# Altium schematic sheet [15] - BOOT OPTIONS.SchDoc: BOOT OPTIONS
size B; Organization: Altium Limited; Address1: L3, 12a Rodborough Rd; Address2: Frenchs Forest; Address3: NSW; Address4: Australia 2086; DocumentNumber: 15; Revision: V1I1; SheetNumber: 15; SheetTotal: 16
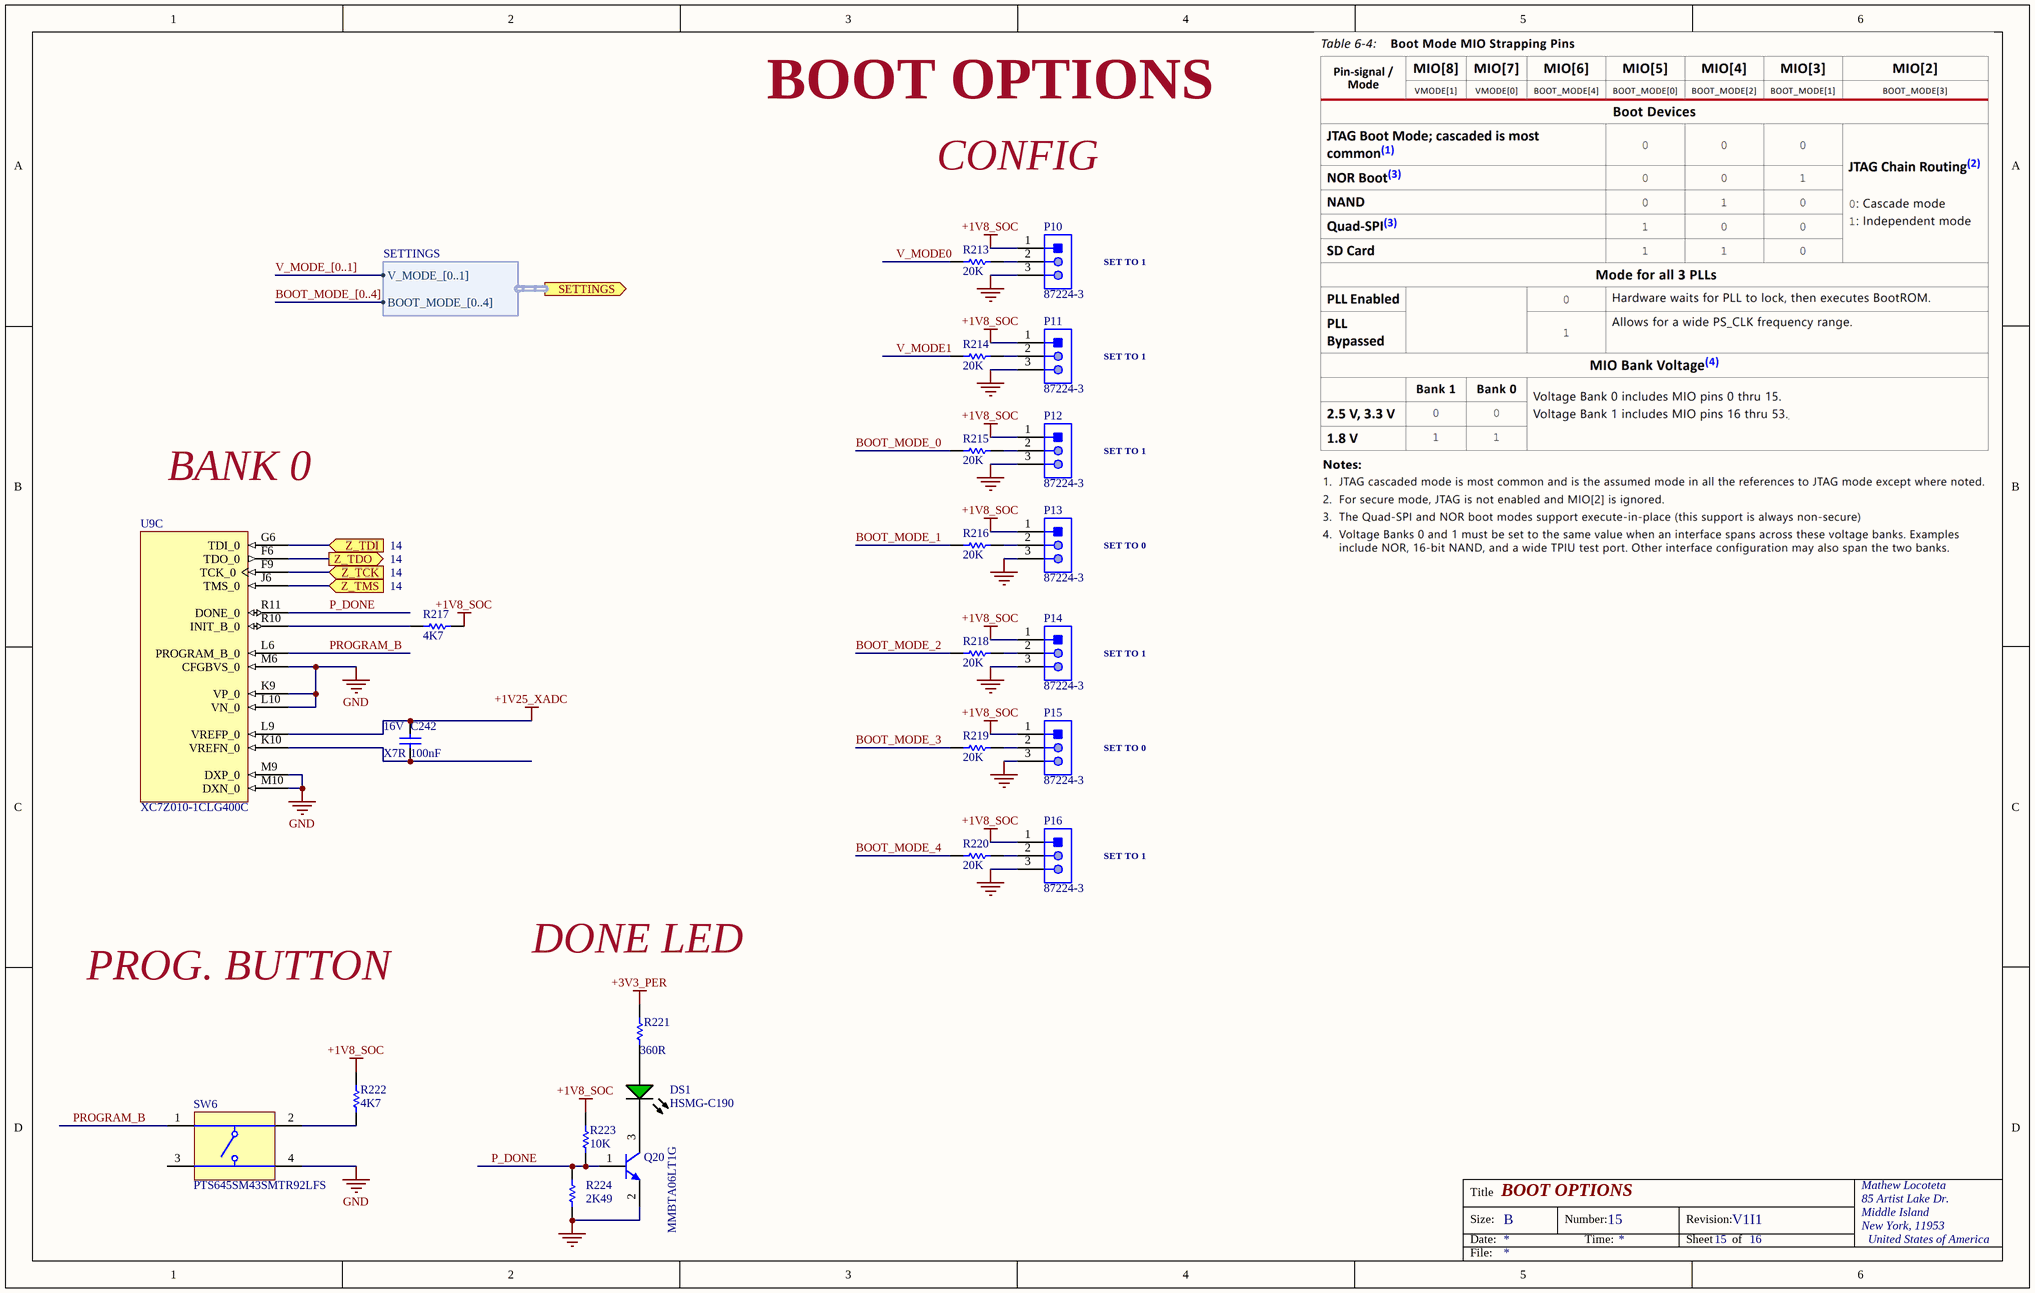
[diagram p0: [15] - BOOT OPTIONS.SchDoc]

## Parts
C242  Dielectric: X7R  Voltage Rating: 16V  Capacitance: 100nF  (hidden comment: 100nF 0402 16V)
DS1  HSMG-C190  [AVAG-HSMX-C190_V]
P10  87224-3  [TECO-87224-3_V]
P11  87224-3  [TECO-87224-3_V]
P12  87224-3  [TECO-87224-3_V]
P13  87224-3  [TECO-87224-3_V]
P14  87224-3  [TECO-87224-3_V]
P15  87224-3  [TECO-87224-3_V]
P16  87224-3  [TECO-87224-3_V]
Q20  MMBTA06LT1G  [ONSC-SOT-23-3-318-08_V]
R213  Resistance: 20K  (hidden comment: 20K 1/8W 1% 0402)
R214  Resistance: 20K  (hidden comment: 20K 1/8W 1% 0402)
R215  Resistance: 20K  (hidden comment: 20K 1/8W 1% 0402)
R216  Resistance: 20K  (hidden comment: 20K 1/8W 1% 0402)
R217  Resistance: 4K7  (hidden comment: 4K7 0402 1%)
R218  Resistance: 20K  (hidden comment: 20K 1/8W 1% 0402)
R219  Resistance: 20K  (hidden comment: 20K 1/8W 1% 0402)
R220  Resistance: 20K  (hidden comment: 20K 1/8W 1% 0402)
R221  value 360R  [RESC1005X40X25NL05T05]  (hidden comment: CRCW0402360RFKED)
R222  Resistance: 4K7  (hidden comment: 4K7 0402 1%)
R223  value 10K  [RESC1005X40X25ML05T10]  (hidden comment: CRCW040210K0FKEDHP)
R224  value 2K49  [RESC1005X40X25ML05T05]  (hidden comment: CRCW04022K49FKTD)
SW6  PTS645SM43SMTR92LFS  [ITT-PTS645S-4_V]
U9  XC7Z010-1CLG400C  [CLG400]  (part C of 9)

## Ports
SETTINGS (out, harness SETTINGS), Z_TCK (in), Z_TDI (in), Z_TDO (out), Z_TMS (in)

## Harnesses
SETTINGS: BOOT_MODE_[0..4], V_MODE_[0..1]

## Nets
+1V8_SOC: P10.1 P11.1 P12.1 P13.1 P14.1 P15.1 P16.1 R217.2 R222.1 R223.2
+1V25_XADC: C242.2 U9.L9(VREFP_0)
+3V3_PER: R221.2
GND: P10.3 P11.3 P12.3 P13.3 P14.3 P15.3 P16.3 Q20.2(E) R224.1 SW6.4 U9.K9(VP_0) U9.L10(VN_0) U9.M6(CFGBVS_0) U9.M9(DXP_0) U9.M10(DXN_0)
BOOT_MODE_0: R215.1
BOOT_MODE_1: R216.1
BOOT_MODE_2: R218.1
BOOT_MODE_3: R219.1
BOOT_MODE_4: R220.1
P_DONE: Q20.1(B) R223.1 R224.2 U9.R11(DONE_0)
PROGRAM_B: SW6.1 U9.L6(PROGRAM_B_0)
V_MODE0: R213.1
V_MODE1: R214.1
Z_TCK: U9.F9(TCK_0) ; port Z_TCK
Z_TDI: U9.G6(TDI_0) ; port Z_TDI
Z_TDO: U9.F6(TDO_0) ; port Z_TDO
Z_TMS: U9.J6(TMS_0) ; port Z_TMS
NetC242_1: C242.1 U9.K10(VREFN_0)
NetDS1_1: DS1.1(A) R221.1
NetDS1_2: DS1.2(K) Q20.3(C)
NetP10_2: P10.2 R213.2
NetP11_2: P11.2 R214.2
NetP12_2: P12.2 R215.2
NetP13_2: P13.2 R216.2
NetP14_2: P14.2 R218.2
NetP15_2: P15.2 R219.2
NetP16_2: P16.2 R220.2
NetR217_1: R217.1 U9.R10(INIT_B_0)
NetR222_2: R222.2 SW6.2

Not connected (* = marked no-connect by the designer): SW6 3

## Buses and harness runs
bus BOOT_MODE_[0..4]
bus V_MODE_[0..1]

## Notes on the sheet
- BOOT OPTIONS
- CONFIG
- SET TO 1
- BANK 0
- 14
- (near R217) 14
- SET TO 0
- DONE LED
- PROG. BUTTON
- Title
- Size:
- Date:
- B
- Number:
- Time:
- Revision:
- Sheet
- of
- Mathew Locoteta
- 85 Artist Lake Dr.
- Middle Island
- New York, 11953
- United States of America
- File:

## Library data of the parts
C242 = C0402C104J4RACTU: KEMET - C0402C104J4RACTU - SMD Multilayer Ceramic Capacitor, 0.1 µF, 16 V, 0402 [1005 Metric], ± 5%, X7R, C Series KEMET; Dissipation Factor: 3.5%; Supplier 1: Digi-Key; Manufacturer: KEMET; Manufacturer Part Number: C0402C104J4RACTU; RoHS: Yes; Category: Ceramic Capacitors; Stock 1: 106350; Pricing 1: 1=0.48000, 10=0.33900, 50=0.25620, 100=0.22310, 500=0.16528, 1000=0.14049, 2500=0.13223, 5000=0.12396 (USD); Mount: Surface Mount,PCB; Case/Package: 0402; Case Code (Metric): 1005; Case Code (Imperial): 0402; Dielectric Material: Ceramic; Contact Plating: Tin,Matte; Min Operating Temperature: -55°C; Max Operating Temperature: 125°C; Tolerance: 5%; Packaging: Tape and Reel; Package Quantity: 1; Termination: SMD/SMT; Voltage: 16V; Length: 1mm; Height: 0.5mm; Width: 0.02inch; Thickness: 0.022inch; Depth: 0.5mm; Radiation Hardening: No; REACH SVHC: No SVHC; ComponentLink1URL: https://datasheet.ciiva.com/5415/kem-c1002-x7r-smd-5415819.pdf?src-supplier=Mouser; ComponentLink1Description: https://datasheet.ciiva.com/5415/kem-c1002-x7r-smd-5415819.pdf?src-supplier=Mouser; ComponentLink2URL: https://datasheet.ciiva.com/46424/1851736-46424159.pdf?src-supplier=Element14; ComponentLink2Description: https://datasheet.ciiva.com/46424/1851736-46424159.pdf?src-supplier=Element14; Supplier Part Number 1: 399-7761-1-ND; Voltage Rating (DC): 16V
DS1 = CMP-1744-00002-1: Chip LED, Green, 2.2 V, -40 to 85 degC, 2-Pin SMD, RoHS, Tape and Reel; Frequency: 400 KHz; Max Supply Voltage: 5.5 V; Access Time: 3500 ns; Clock Frequency: 100 KHz; Case\Package: SOIC; Density: 32 kb; Nominal Supply Current: 2 mA; Interface: Serial; Min Supply Voltage: 1.7 V; Packaging: Tape and Reel; PackageReference: HSMX-C190; ComponentLink2URL: http://docs.avagotech.com/docs/AV02-0551EN; RoHSCompliant: true; Pins: 8; REACH SVHC: No SVHC; Max Operating Temperature: 85 degC; Width: 4 mm; Radiation Hardening: No; Package Quantity: 3000; ComponentLink3Description: Package Specification; ComponentLink1Description: Manufacturer URL; Min Operating Temperature: -40 degC; PackageDescription: 2-Pin Surface Mount Device, Body 1.6 x 0.8 mm, Height 0.9 mm; Max Clock Frequency: 100 KHz; Height: 1.5 mm; ComponentLink1URL: http://www.avagotech.com/; DatasheetVersion: Mar-12; ComponentLink2Description: Datasheet; Mount: Surface Mount; Length: 5 mm; ComponentLink3URL: http://www.fairchildsemi.com/dwg/MA/MA03D.pdf
P10-P16 = CMP-2000-05697-1: Male Header, Pitch 2.54 mm, 1 x 3 Position, Height 10.744 mm, Tail Length 3.175 mm, -65 to 105 degC, RoHS, Bulk; Manufacturer: TE Connectivity; Catalog Drawings: SingleSquareStraightPost / SingleSquareStraightPostSide; Connector Type: Header,Unshrouded; Pitch: 0.100"(2.54mm); Mating Products: 147738-2-ND / -CONNRCPT3POSVERTSMDGOLD / 147723-2-ND / -CONNRCPT3POSVERT.100GOLD / 146763-5-ND / -CONNRCPT3POSSGLVERT.100T/H / A32904-ND / -CONNRECEPT3POS.100VERTGOLD / A26922-ND / -CONNHOUSING3POS.100LOCKING / A26415-ND / -CONNRECEPT3POS.100VERTAU / A26964-ND / -CONNHOUSING3POS.100SINGLE / A3012-ND / -CONNHOUSING3POS.100SINGLE; Number of Positions Loaded: All; Featured Product: AMPMODUConnectors; Dynamic Catalog: AMPMODUModIISeries; 3D Model: 87224-3.pdf; Other Names: 87224-3-ND / A26545; Number of Positions: 3; RoHS Information: 87224-3StatementofCompliance; Termination: Solder; Datasheet URL: http://www.te.com/commerce/DocumentDelivery/DDEController?Action=showdoc&DocId=Customer+Drawing%7F87224%7FL3%7Fpdf%7FEnglish%7FENG_CD_87224_L3.pdf%7F87224-3; Category: Connectors,Interconnects; Contact Mating Length: 0.318"(8.08mm); Standard Package: 520; Mounting Type: ThroughHole; Family: RectangularConnectors-Headers,MalePins; Number of Rows: 1; Series: AMPMODUModII; Contact Finish Thickness: 15µin(0.38µm); Datasheet Version: Rev. L3, 08/2015; Package Reference: 87224-3; Mounting Technology: ThroughHole; Manufacturer URL: http://www.te.com/; Contact Type: MalePin; Packaging: Bulk; Color: Black; Package Description: Male Header, Pitch 2.54 mm, 1 x 3 Position, Height 10.744 mm, Tail Length 3.175 mm; Contact Finish: Gold
Q20 = CMP-1048-00619-1: Driver Transistor, NPN Silicon, 3-Pin SOT-23, Pb-Free, Tape and Reel; Manufacturer: On Semiconductor; IC Continuous (A): 0.5; fT Min (MHz): 100; ComponentLink1URL: http://www.onsemi.com/; ComponentLink1Description: Manufacturer URL; ComponentLink2Description: Datasheet; ComponentLink3URL: http://www.onsemi.cn/pub_link/Collateral/318-08.PDF; Packing: Tape and Reel; PackageVersion: Rev. AP, 11/2009; PackageDescription: 3-Pin Small Outline Transistor, Body 2.92 x 1.3 mm, Pitch 0.95 mm; RoHS: TRUE; PartNumber: MMBTA06LT1G; ComponentLink2URL: http://www.onsemi.cn/pub_link/Collateral/MMBTA05LT1-D.PDF; DatasheetVersion: Rev. 8; PackageReference: SOT-23-3-318-08; Polarity: NPN; ComponentLink3Description: Package Specification; Mounting Technology: Surface Mount
R213-R216 R218-R220 = CRCW040220K0FKEDHP: Res Thick Film 0402 20K Ohm 1% 1/8W 100ppm/C Molded SMD SMD Paper T/R; Manufacturer: Vishay Dale; Temperature Coefficient: 100ppm/°C; Voltage Rating: 50V; Max Power Dissipation: 125mW; Supplier 1: Digi-Key; Manufacturer Part Number: CRCW040220K0FKEDHP; RoHS: Yes; Category: Chip SMD Resistors; Stock 1: 24303; Pricing 1: 1=0.14000, 10=0.12100, 100=0.04670, 1000=0.02053, 2500=0.01773, 5000=0.01586 (USD); Mount: Surface Mount; Case/Package: 0402; Weight: 2.3E-05oz; Contact Plating: Tin; Case Code (Metric): 1005; Case Code (Imperial): 0402; Min Operating Temperature: -55°C; Max Operating Temperature: 155°C; Composition: Thick Film; Tolerance: 1%; Packaging: Tape and Reel; Features: Automotive AEC-Q200; Number of Terminations: 2; Termination: SMD/SMT; Package Quantity: 10; Power Rating: 125mW; Length: 1mm; Height: 0.3mm; Depth: 0.5mm; Width: 0.02inch; Radiation Hardening: No; Lead Free: Lead Free; ComponentLink1URL: https://datasheet.ciiva.com/2498/crcwhpe3-2498725.pdf?src-supplier=Digi-Key; ComponentLink1Description: https://datasheet.ciiva.com/2498/crcwhpe3-2498725.pdf?src-supplier=Digi-Key; ComponentLink2URL: https://datasheet.ciiva.com/2498/crcwhpe3-2498726.pdf?src-supplier=Digi-Key; ComponentLink2Description: https://datasheet.ciiva.com/2498/crcwhpe3-2498726.pdf?src-supplier=Digi-Key; ComponentLink3URL: https://datasheet.ciiva.com/5552/crcwhpe3-46056-5552662.pdf?src-supplier=Mouser; ComponentLink3Description: https://datasheet.ciiva.com/5552/crcwhpe3-46056-5552662.pdf?src-supplier=Mouser; ComponentLink4URL: https://datasheet.ciiva.com/2498/crcwhpe3-2498727.pdf?src-supplier=Digi-Key; ComponentLink4Description: https://datasheet.ciiva.com/2498/crcwhpe3-2498727.pdf?src-supplier=Digi-Key; ComponentLink5URL: https://datasheet.ciiva.com/9033/crcwhpe3-9033402.pdf?src-supplier=Avnet; ComponentLink5Description: https://datasheet.ciiva.com/9033/crcwhpe3-9033402.pdf?src-supplier=Avnet; ComponentLink6URL: https://datasheet.ciiva.com/48526/crcwhpe3-48526365.pdf?src-supplier=Avnet; ComponentLink6Description: https://datasheet.ciiva.com/48526/crcwhpe3-48526365.pdf?src-supplier=Avnet; ComponentLink7URL: https://datasheet.ciiva.com/16886/crcwhpe3-16886590.pdf?src-supplier=Avnet+Europe; ComponentLink7Description: https://datasheet.ciiva.com/16886/crcwhpe3-16886590.pdf?src-supplier=Avnet+Europe; Supplier Part Number 1: 541-20.0KYCT-ND
R217 R222 = CRCW04024K70FKED: Resistor SMD 4.7 kOhm 0402 PU=10000 ST, CRCW04024K70FKED, Vishay; Power Rating: 63mW; Temperature Coefficient: 100ppm/°C; Voltage Rating: 50V; Supplier 1: Digi-Key; Manufacturer: Vishay; Manufacturer Part Number: CRCW04024K70FKED; RoHS: Yes; Category: Chip SMD Resistors; Stock 1: 575743; Pricing 1: 1=0.10000, 10=0.03500, 100=0.01410, 1000=0.00633, 2500=0.00550, 5000=0.00454 (USD); Mount: Surface Mount; Case/Package: 0402; Weight: 2.3E-05oz; Contact Plating: Tin; Case Code (Imperial): 0402; Case Code (Metric): 1005; Min Operating Temperature: -55°C; Max Operating Temperature: 155°C; Tolerance: 1%; Composition: Thick Film; Packaging: Tape and Reel; Package Quantity: 10; Termination: SMD/SMT; Military Standard: Not; Voltage Rating (DC): 50V; Number of Terminations: 2; Max Power Dissipation: 63mW; Features: Automotive AEC-Q200; Length: 1mm; Height: 0.35mm; Width: 0.5mm; Depth: 0.5mm; Radiation Hardening: No; Lead Free: Lead Free; REACH SVHC: Unknown; ComponentLink1URL: https://datasheet.ciiva.com/11808/0900766b80d98824-11808622.pdf?src-supplier=RSComponents; ComponentLink1Description: https://datasheet.ciiva.com/11808/0900766b80d98824-11808622.pdf?src-supplier=RSComponents; ComponentLink2URL: https://datasheet.ciiva.com/3256/dcrcwe3-3256597.pdf?src-supplier=Avnet; ComponentLink2Description: https://datasheet.ciiva.com/3256/dcrcwe3-3256597.pdf?src-supplier=Avnet; ComponentLink3URL: https://datasheet.ciiva.com/5550/dcrcwe3-109170-5550295.pdf?src-supplier=Mouser; ComponentLink3Description: https://datasheet.ciiva.com/5550/dcrcwe3-109170-5550295.pdf?src-supplier=Mouser; ComponentLink4URL: https://datasheet.ciiva.com/16764/70201119-16764281.pdf?src-supplier=Allied+Electronics; ComponentLink4Description: https://datasheet.ciiva.com/16764/70201119-16764281.pdf?src-supplier=Allied+Electronics; ComponentLink5URL: https://datasheet.ciiva.com/2463/dcrcwe3-2463034.pdf?src-supplier=Digi-Key; ComponentLink5Description: https://datasheet.ciiva.com/2463/dcrcwe3-2463034.pdf?src-supplier=Digi-Key; ComponentLink6URL: https://datasheet.ciiva.com/16881/dcrcwe3-16881690.pdf?src-supplier=Avnet+Europe; ComponentLink6Description: https://datasheet.ciiva.com/16881/dcrcwe3-16881690.pdf?src-supplier=Avnet+Europe; ComponentLink7URL: https://datasheet.ciiva.com/2463/dcrcwe3-2463035.pdf?src-supplier=Digi-Key; ComponentLink7Description: https://datasheet.ciiva.com/2463/dcrcwe3-2463035.pdf?src-supplier=Digi-Key; ComponentLink8URL: https://datasheet.ciiva.com/8079/1697337-8079643.pdf?src-supplier=Element14; ComponentLink8Description: https://datasheet.ciiva.com/8079/1697337-8079643.pdf?src-supplier=Element14; ComponentLink9URL: https://datasheet.ciiva.com/2463/dcrcwe3-2463036.pdf?src-supplier=Digi-Key; ComponentLink9Description: https://datasheet.ciiva.com/2463/dcrcwe3-2463036.pdf?src-supplier=Digi-Key; ComponentLink10URL: https://datasheet.ciiva.com/26316/fld-crcw-e3-data-en-26316654.pdf?src-supplier=Distrelec; ComponentLink10Description: https://datasheet.ciiva.com/26316/fld-crcw-e3-data-en-26316654.pdf?src-supplier=Distrelec; Supplier Part Number 1: 541-4.70KLCT-ND
R221 = CMP-2002-08546-1: Manufacturer: Vishay Dale; Part Number: CRCW0402360RFKED
R223 = CMP-2002-03043-1: Manufacturer: Vishay Dale; Part Number: CRCW040210K0FKEDHP
R224 = CMP-2002-00377-1: Manufacturer: Vishay Dale; Part Number: CRCW04022K49FKTD
SW6 = CMP-2000-05160-1: 6 mm Tact Switche, SPST, NO, -20 to 60 degC, 4-Pin SMT, RoHS, Tape and Reel; Manufacturer: ITT Cannon; Manufacturer URL: http://www.ittcannon.com/; Datasheet Version: Feb-14; Datasheet URL: https://datasheet.ciiva.com/29903/getdatasheetpartid-786341-29903846.pdf
U9 = CMP-0363-00007-3: 667 MHz Zynq™-7000 AP SoC, 130 PS I/O, 100 FPGA I/O, 400-Ball BGA, Speed Grade 1, Commercial Grade, Pb-Free; Flip Flops: 35200; Speed Grade: -1; LUTs: 17600; Extensible Block RAM (# 36Kb Blocks): 240 KB (60); ComponentLink6Description: PCB and Layout Guide; ComponentLink3Description: DC and AC Switching Characteristics; ComponentLink2URL: http://www.xilinx.com/support/documentation/user_guides/ug865-Zynq-7000-Pkg-Pinout.pdf; PackageReference: CLG400; ComponentLink3URL: http://www.xilinx.com/support/documentation/data_sheets/ds187-XC7Z010-XC7Z020-Data-Sheet.pdf; DatasheetVersion: v1.2; Generic Part Number: XC7Z010; ComponentLink2Description: Package Specification; ComponentLink1Description: Datasheet; PartNumber: XC7Z010-1CLG400C; ComponentLink5Description: Packaging and Pinout; Code_JEDEC: MO-275-MMAA-1; RoHS: Pb-Free; ComponentLink5URL: http://www.xilinx.com/support/documentation/user_guides/ug865-Zynq-7000-Pkg-Pinout.pdf; ComponentLink1URL: http://www.xilinx.com/support/documentation/data_sheets/ds190-Zynq-7000-Overview.pdf; ComponentLink4Description: Package File; ComponentLink4URL: http://www.xilinx.com/support/packagefiles/z7packages/xc7z010clg400pkg.txt; PackageDescription: Wire-Bond Chip-Scale BGA, Body 17 x 17 mm, 0.8 mm Pitch; PackageVersion: Rev 1.1, 09/2012; Mounting Technology: Surface Mount; ComponentLink6URL: http://www.xilinx.com/support/documentation/user_guides/ug483_7Series_PCB.pdf